# EAGLE schematic TouchGlove (EAGLE 9.0.1)
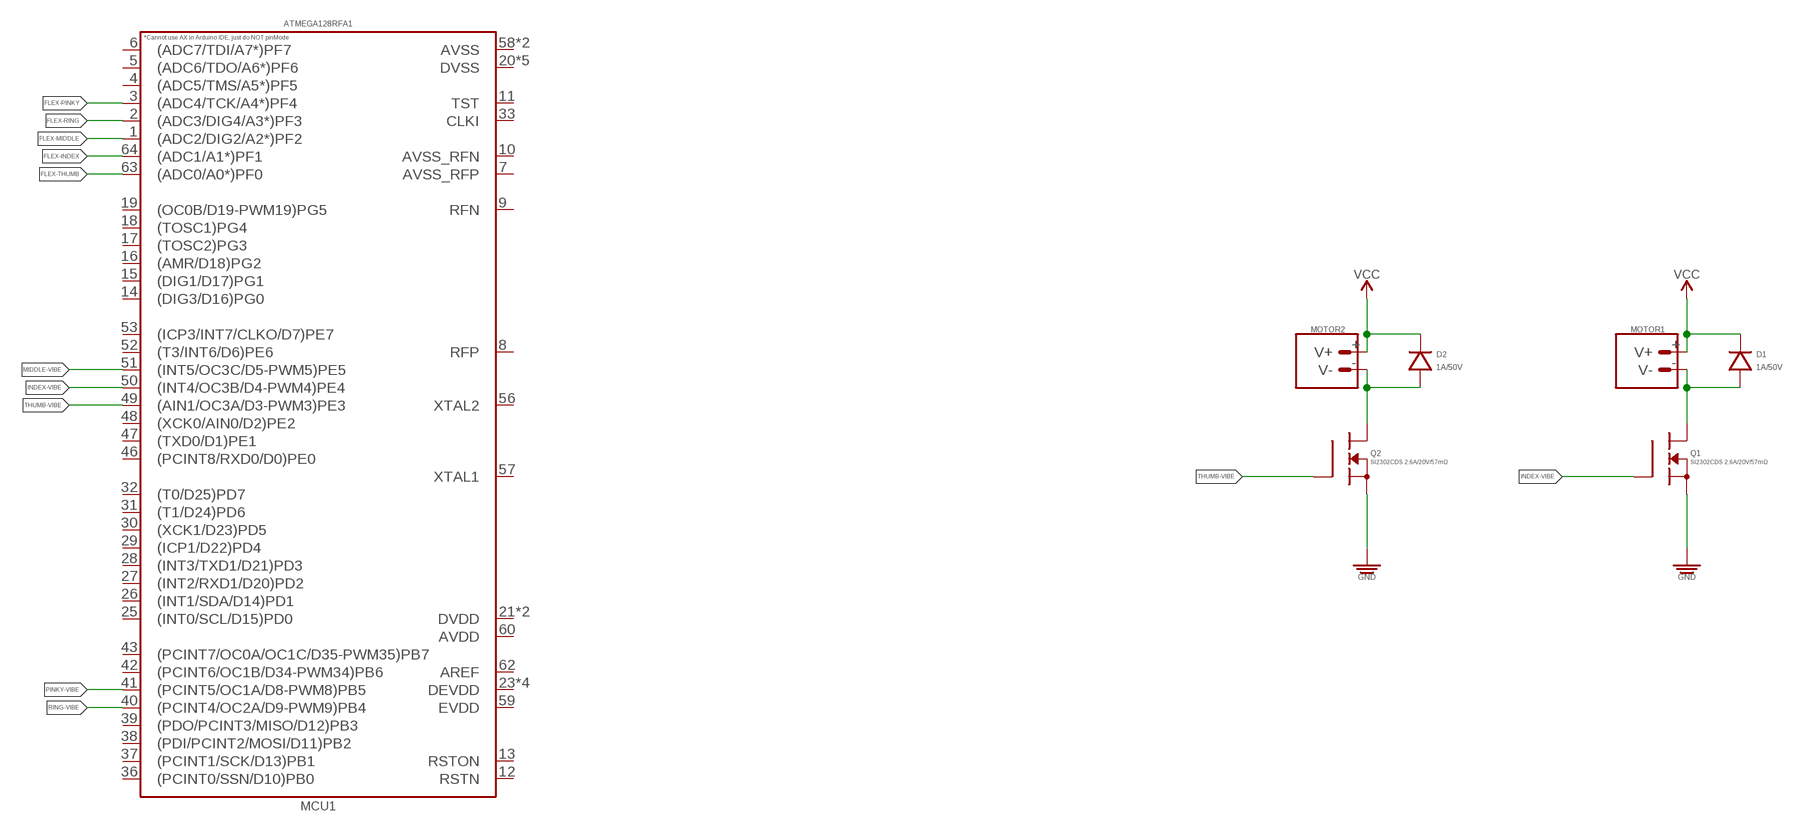
[diagram p0: schematic, sheet 1, part 1 of 2]
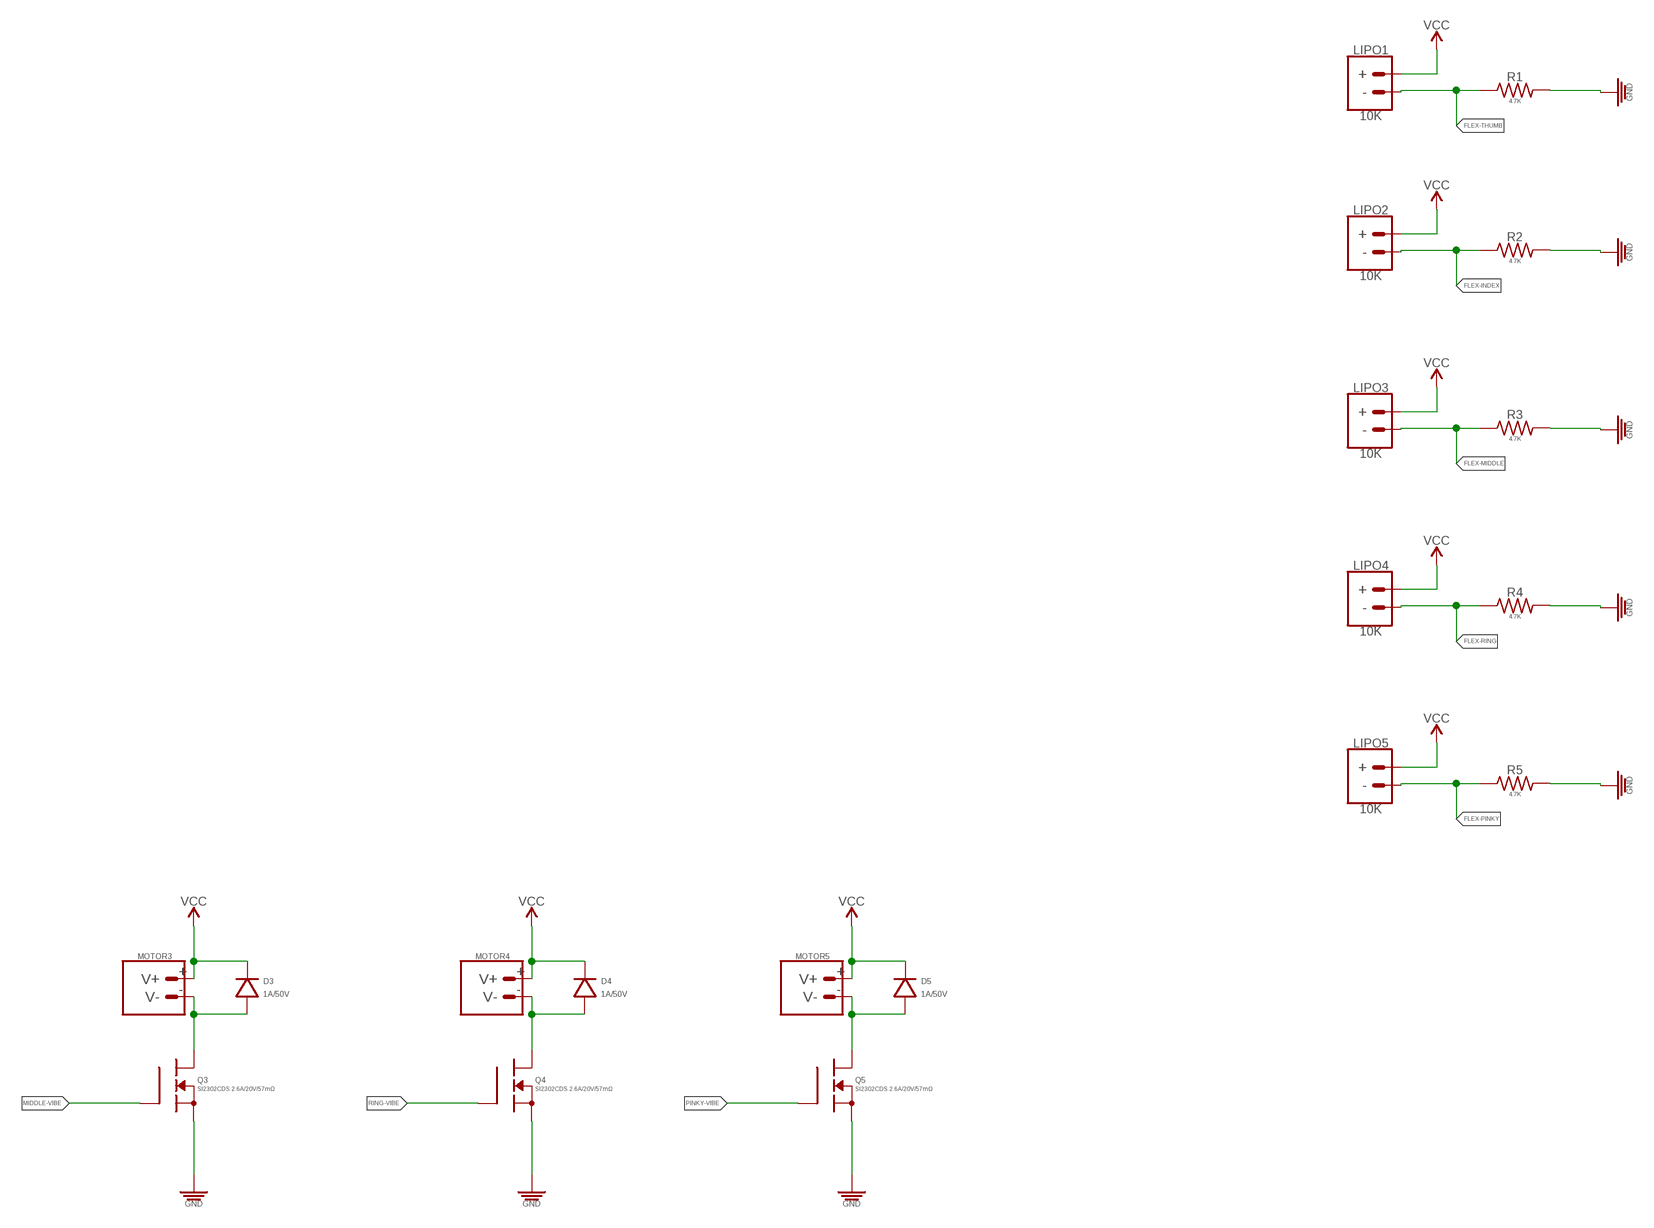
[diagram p1: schematic, sheet 1, part 2 of 2]

## Parts
D1  1A/50V  DIODE_GENERAL-PURPOSE_SMD_GP_1A-50V  [SOD123F]
D2  1A/50V  DIODE_GENERAL-PURPOSE_SMD_GP_1A-50V  [SOD123F]
D3  1A/50V  DIODE_GENERAL-PURPOSE_SMD_GP_1A-50V  [SOD123F]
D4  1A/50V  DIODE_GENERAL-PURPOSE_SMD_GP_1A-50V  [SOD123F]
D5  1A/50V  DIODE_GENERAL-PURPOSE_SMD_GP_1A-50V  [SOD123F]
LIPO1  10K  FLEX_SENSOR_89400_VERT-MALE_PITCH-2MM  [_MOLEX-89400_VERT_PITCH-2MM]
LIPO2  10K  FLEX_SENSOR_89400_VERT-MALE_PITCH-2MM  [_MOLEX-89400_VERT_PITCH-2MM]
LIPO3  10K  FLEX_SENSOR_89400_VERT-MALE_PITCH-2MM  [_MOLEX-89400_VERT_PITCH-2MM]
LIPO4  10K  FLEX_SENSOR_89400_VERT-MALE_PITCH-2MM  [_MOLEX-89400_VERT_PITCH-2MM]
LIPO5  10K  FLEX_SENSOR_89400_VERT-MALE_PITCH-2MM  [_MOLEX-89400_VERT_PITCH-2MM]
MCU1  ATMEGA128RFA1  ATMEGA128RFA1_VFQFN-64_EXPOSED-PAD  [VFQFN-64]
MOTOR1  MOTOR_PADSPTH  [CONNECTOR_MOTOR]
MOTOR2  MOTOR_PADSPTH  [CONNECTOR_MOTOR]
MOTOR3  MOTOR_PADSPTH  [CONNECTOR_MOTOR]
MOTOR4  MOTOR_PADSPTH  [CONNECTOR_MOTOR]
MOTOR5  MOTOR_PADSPTH  [CONNECTOR_MOTOR]
Q1  SI2302CDS 2.6A/20V/57mΩ  MOSFET_N-CHANNEL_SI2302CDS_2.6A-20V-0.057OHM  [SOT23-3]
Q2  SI2302CDS 2.6A/20V/57mΩ  MOSFET_N-CHANNEL_SI2302CDS_2.6A-20V-0.057OHM  [SOT23-3]
Q3  SI2302CDS 2.6A/20V/57mΩ  MOSFET_N-CHANNEL_SI2302CDS_2.6A-20V-0.057OHM  [SOT23-3]
Q4  SI2302CDS 2.6A/20V/57mΩ  MOSFET_N-CHANNEL_SI2302CDS_2.6A-20V-0.057OHM  [SOT23-3]
Q5  SI2302CDS 2.6A/20V/57mΩ  MOSFET_N-CHANNEL_SI2302CDS_2.6A-20V-0.057OHM  [SOT23-3]
R1  4.7K  4.7KΩ_SMD-0805_1/8W-5%  [RESISTOR_SMD-805]
R2  4.7K  4.7KΩ_SMD-0805_1/8W-5%  [RESISTOR_SMD-805]
R3  4.7K  4.7KΩ_SMD-0805_1/8W-5%  [RESISTOR_SMD-805]
R4  4.7K  4.7KΩ_SMD-0805_1/8W-5%  [RESISTOR_SMD-805]
R5  4.7K  4.7KΩ_SMD-0805_1/8W-5%  [RESISTOR_SMD-805]

## Nets
FLEX-INDEX: LIPO2.2(-) MCU1.64((ADC1/A1*)PF1) R2.1
FLEX-MIDDLE: LIPO3.2(-) MCU1.1((ADC2/DIG2/A2*)PF2) R3.1
FLEX-PINKY: LIPO5.2(-) MCU1.3((ADC4/TCK/A4*)PF4) R5.1
FLEX-RING: LIPO4.2(-) MCU1.2((ADC3/DIG4/A3*)PF3) R4.1
FLEX-THUMB: LIPO1.2(-) MCU1.63((ADC0/A0*)PF0) R1.1
GND: Q1.S Q2.S Q3.S Q4.S Q5.S R1.2 R2.2 R3.2 R4.2 R5.2
INDEX-VIBE: MCU1.50((INT4/OC3B/D4-PWM4)PE4) Q1.G
MIDDLE-VIBE: MCU1.51((INT5/OC3C/D5-PWM5)PE5) Q3.G
N$1: D1.A MOTOR1.-(V-) Q1.D
N$2: D2.A MOTOR2.-(V-) Q2.D
N$3: D3.A MOTOR3.-(V-) Q3.D
N$4: D4.A MOTOR4.-(V-) Q4.D
N$5: D5.A MOTOR5.-(V-) Q5.D
PINKY-VIBE: MCU1.41((PCINT5/OC1A/D8-PWM8)PB5) Q5.G
RING-VIBE: MCU1.40((PCINT4/OC2A/D9-PWM9)PB4) Q4.G
THUMB-VIBE: MCU1.49((AIN1/OC3A/D3-PWM3)PE3) Q2.G
VCC: D1.K D2.K D3.K D4.K D5.K LIPO1.1(+) LIPO2.1(+) LIPO3.1(+) LIPO4.1(+) LIPO5.1(+) MOTOR1.+(V+) MOTOR2.+(V+) MOTOR3.+(V+) MOTOR4.+(V+) MOTOR5.+(V+)
Unconnected: MCU1.4((ADC5/TMS/A5*)PF5) MCU1.5((ADC6/TDO/A6*)PF6) MCU1.6((ADC7/TDI/A7*)PF7) MCU1.7(AVSS_RFP) MCU1.8(RFP) MCU1.9(RFN) MCU1.10(AVSS_RFN) MCU1.11(TST) MCU1.12(RSTN) MCU1.13(RSTON) MCU1.14((DIG3/D16)PG0) MCU1.15((DIG1/D17)PG1) MCU1.16((AMR/D18)PG2) MCU1.17((TOSC2)PG3) MCU1.18((TOSC1)PG4) MCU1.19((OC0B/D19-PWM19)PG5) MCU1.20(DVSS) MCU1.21(DVDD) MCU1.22(DVDD) MCU1.23(DEVDD) MCU1.24(DVSS) MCU1.25((INT0/SCL/D15)PD0) MCU1.26((INT1/SDA/D14)PD1) MCU1.27((INT2/RXD1/D20)PD2) MCU1.28((INT3/TXD1/D21)PD3) MCU1.29((ICP1/D22)PD4) MCU1.30((XCK1/D23)PD5) MCU1.31((T1/D24)PD6) MCU1.32((T0/D25)PD7) MCU1.33(CLKI) MCU1.34(DEVDD) MCU1.35(DVSS) MCU1.36((PCINT0/SSN/D10)PB0) MCU1.37((PCINT1/SCK/D13)PB1) MCU1.38((PDI/PCINT2/MOSI/D11)PB2) MCU1.39((PDO/PCINT3/MISO/D12)PB3) MCU1.42((PCINT6/OC1B/D34-PWM34)PB6) MCU1.43((PCINT7/OC0A/OC1C/D35-PWM35)PB7) MCU1.44(DEVDD) MCU1.45(DVSS) MCU1.46((PCINT8/RXD0/D0)PE0) MCU1.47((TXD0/D1)PE1) MCU1.48((XCK0/AIN0/D2)PE2) MCU1.52((T3/INT6/D6)PE6) MCU1.53((ICP3/INT7/CLKO/D7)PE7) MCU1.54(DEVDD) MCU1.55(DVSS) MCU1.56(XTAL2) MCU1.57(XTAL1) MCU1.58(AVSS) MCU1.59(EVDD) MCU1.60(AVDD) MCU1.61(AVSS) MCU1.62(AREF)

## Library data of the parts
D1-D5 = PiB_discrete_semiconductors:DIODE_GENERAL-PURPOSE; CREATOR: MrSwirlyEyes; DATASHEET: http://www.comchiptech.com/cms/UserFiles/CGRKM4001-HF%20Thru.%20CGRKM4007-HF%20RevG.pdf; DIST: Digikey; DISTLINK: https://www.digikey.com/products/en?keywords=641-1511-1-ND; DISTPN: 641-1511-1-ND; MFR: Comchip Technology; MPN: CGRKM4001-HF; TESTED: NO
LIPO1-LIPO5 = PiB_sensors:FLEX_SENSOR; DATASHEET: http://www.spectrasymbol.com/wp-content/uploads/2016/12/FLEX-SENSOR-DATA-SHEET-v2014-Rev-A.pdf; DATASHEET_CONNECTOR1: https://www.molex.com/pdm_docs/sd/894000220_sd.pdf; DATASHEET_CONNECTOR2: https://www.molex.com/pdm_docs/sd/873690200_sd.pdf; DATASHEET_CRIMP: https://www.molex.com/pdm_docs/sd/502128000_sd.pdf; DIST: Sparkfun; DISTLINK: https://www.sparkfun.com/products/8606; DISTLINK_CONNECTOR1: https://www.digikey.com/products/en?keywords=WM4340-ND; DISTLINK_CONNECTOR2: https://www.digikey.com/products/en?keywords=WM10118-ND; DISTLINK_CRIMP: https://www.digikey.com/products/en?keywords=WM4561CT-ND; DISTPN: SEN-08606; DISTPN_CONNECTOR1: WM4340-ND; DISTPN_CONNECTOR2: WM10118-ND; DISTPN_CRIMP: WM4561CT-ND; DIST_CONNECTOR1: Digikey; DIST_CONNECTOR2: Digikey; DIST_CRIMP: Digikey; MFR: Spectra Symbol; MFR_CONNECTOR1: Molex, LLC; MFR_CONNECTOR2: Molex, LLC; MFR_CRIMP: Molex, LLC; MPN: FS-L-0095-103-ST; MPN_CONNECTOR1: 0894000220; MPN_CONNECTOR2: 0873690200; MPN_CRIMP: 50212-8000
MCU1 = PiB_ic_microcontrollers:ATMEGA128RFA1: ATmega128RFA1 8-bit AVR Microcontroller with Low Power 2.4GHz Transceiver for ZigBee and IEEE 802.15.4; CREATOR: Kenmei; DATASHEET: http://www.atmel.com/Images/Atmel-8266-MCU_Wireless-ATmega128RFA1_Datasheet.pdf; DIST: Digikey; DISTLINK: https://www.digikey.com/products/en?mpart=ATMEGA128RFA1-ZU; DISTPN: ATMEGA128RFA1-ZU-ND; MFR: Atmel; MPN: ATMEGA128RFA1-ZU; TESTED: YES
MOTOR1-MOTOR5 = PiB:MOTOR_PADS
Q1-Q5 = PiB_discrete_semiconductors:MOSFET_N-CHANNEL; CREATOR: MrSwirlyEyes; DATASHEET: http://www.vishay.com/docs/68645/si2302cds.pdf; DIST: Digikey; DISTLINK: https://www.digikey.com/product-detail/en/vishay-siliconix/SI2302CDS-T1-GE3/SI2302CDS-T1-GE3CT-ND/1978877; DISTPN: SI2302CDS-T1-GE3CT-ND; MFR: Vishay Siliconix; MPN: SI2302CDS-T1-GE3; TESTED: NO
R1-R5 = PiB_resistors:4.7KΩ; CREATOR: MrSwirlyEyes; DATASHEET: http://www.yageo.com/documents/recent/PYu-RC_Group_51_RoHS_L_7.pdf; DIST: Digikey; DISTLINK: https://www.digikey.com/products/en?keywords=311-4.7KARCT-ND; DISTPN: 311-4.7KARCT-ND; MFR: Yageo; MPN: RC0805JR-074K7L